# Altium schematic sheet BUTTON.SchDoc
size A; SheetNumber: 9; SheetTotal: 9
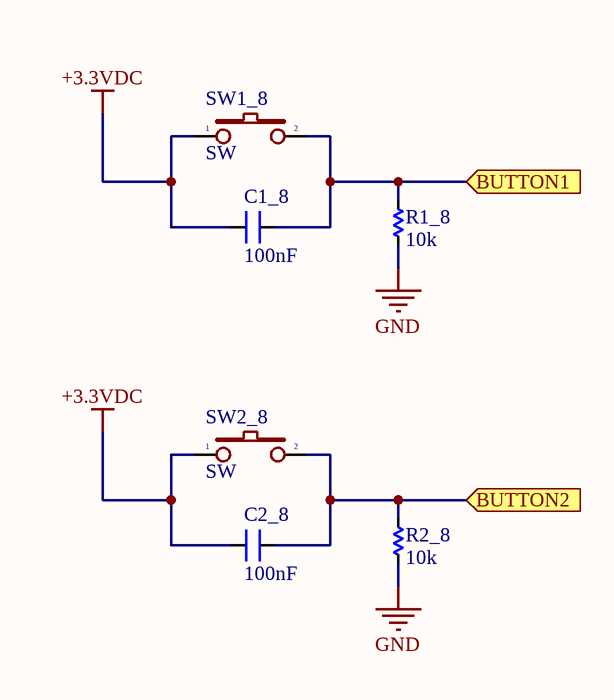
[diagram p0: BUTTON.SchDoc]

## Parts
C1_8  100nF  [CN-SMD-0805]
C2_8  100nF  [CN-SMD-0805]
R1_8  10k  [RES-SMD-0805]
R2_8  10k  [RES-SMD-0805]
SW1_8  SW  [SW1-DIP]
SW2_8  SW  [SW1-DIP]

## Ports
BUTTON1 (in), BUTTON2 (in)

## Nets
+3.3VDC: C1_8.1 C2_8.1 SW1_8.1 SW2_8.1
GND: R1_8.2 R2_8.2
BUTTON1: C1_8.2 R1_8.1 SW1_8.2 ; port BUTTON1
BUTTON2: C2_8.2 R2_8.1 SW2_8.2 ; port BUTTON2

## Library data of the parts
C1_8 C2_8 = CN: Value: 33pF
R1_8 R2_8 = Res-SMD: Resistor; Manufacturer: Generic Components; Class: Passive; Published: 08/06/2000; Publisher: Altium Hobart Technology Centre
SW1_8 SW2_8 = SW2: Switch button 2 pin; Value: SW chip 2 pin